# EAGLE schematic BMS Adapter Segment rev1 (EAGLE 8.1.0)
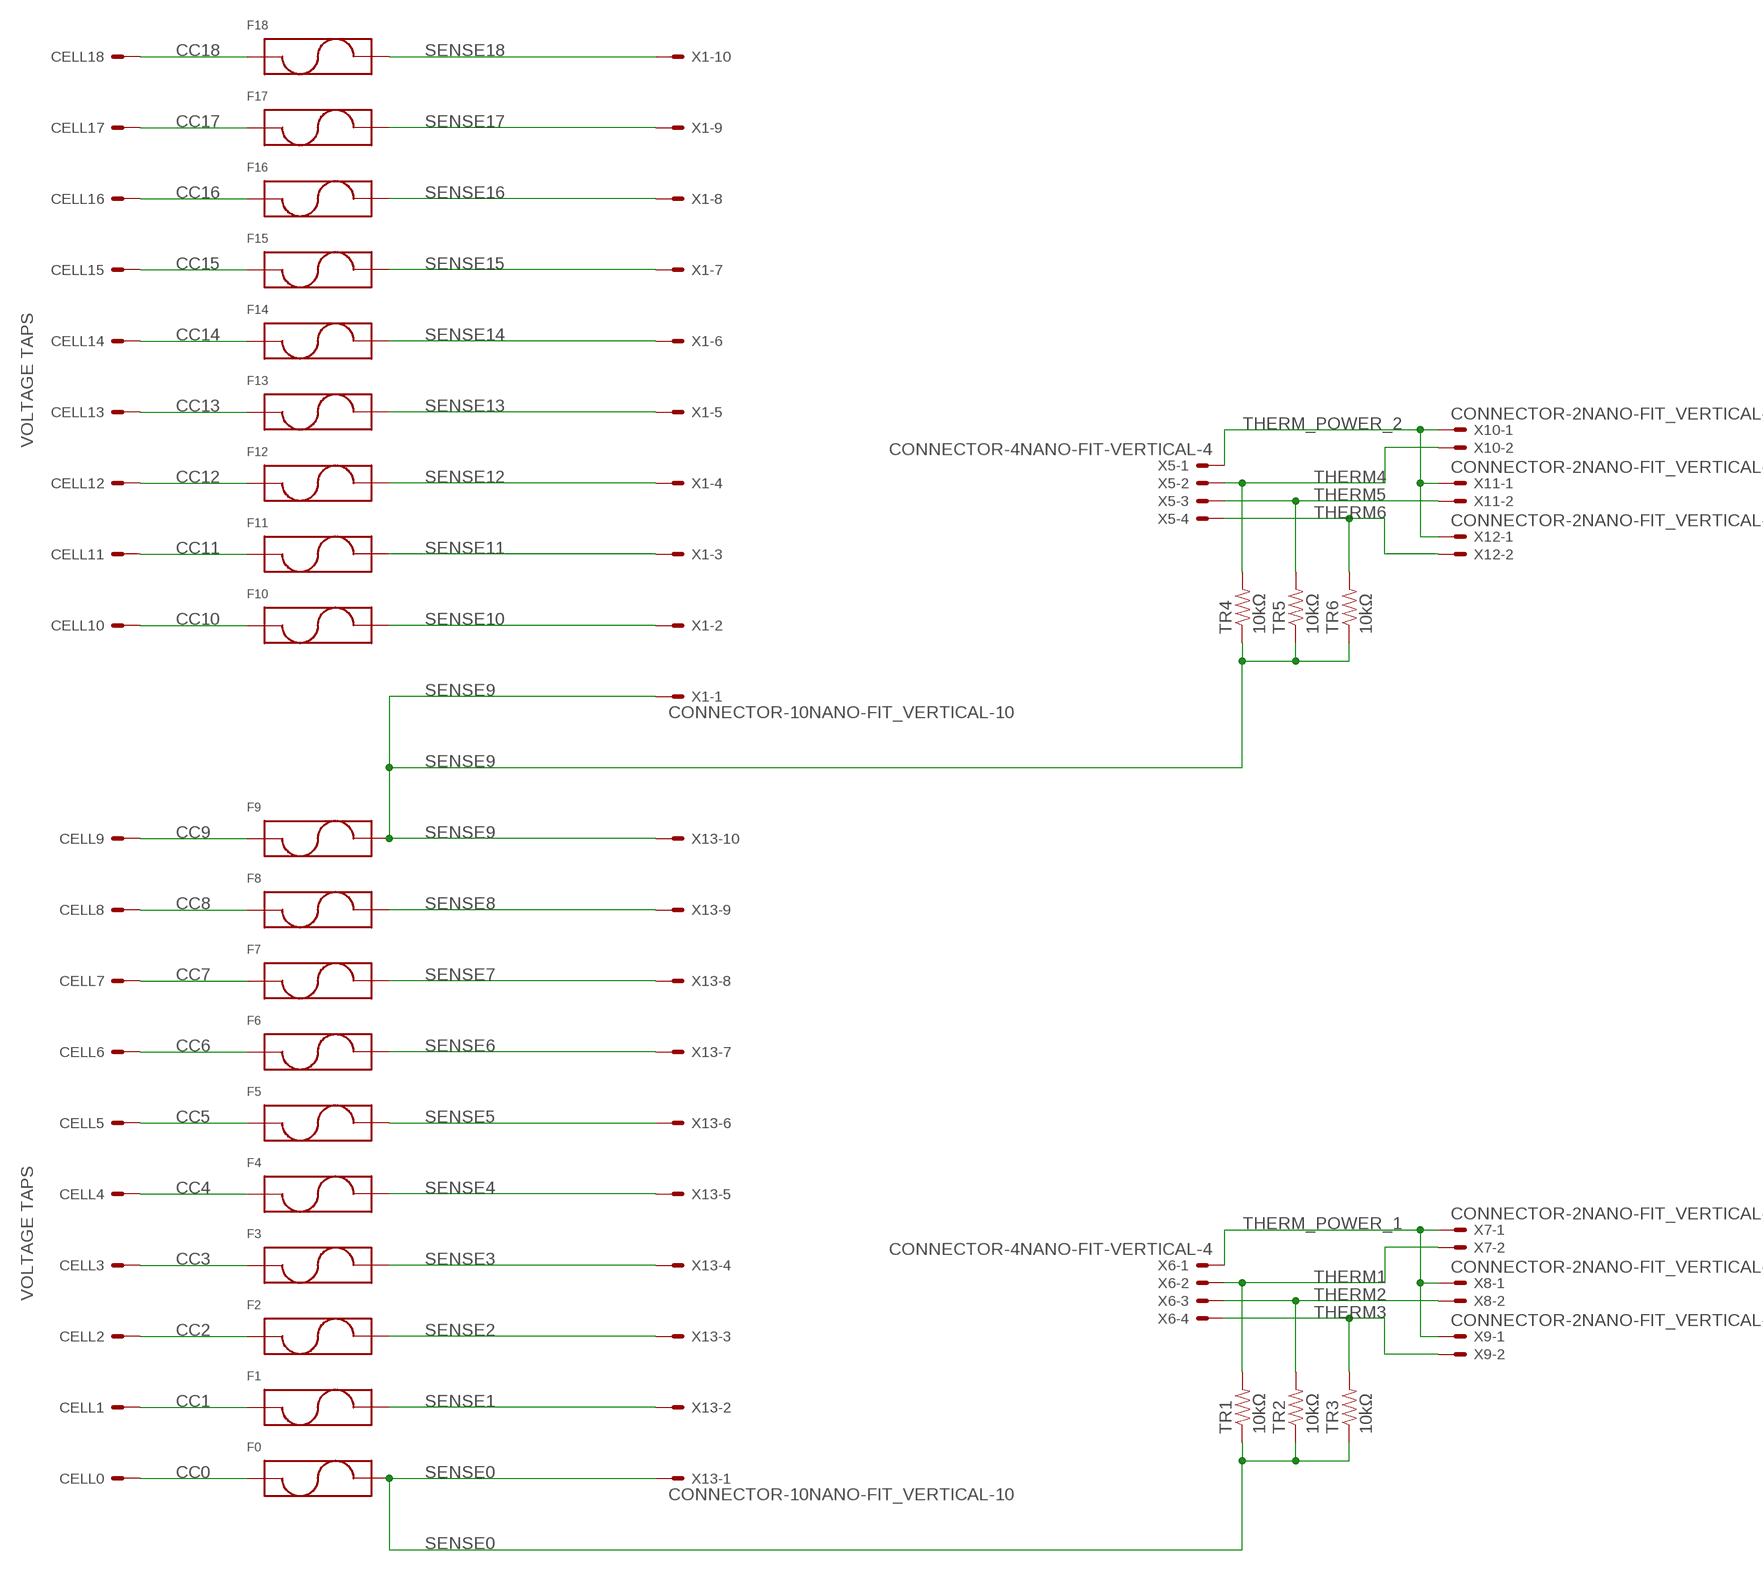
[diagram p0: schematic, sheet 1]

## Parts
CELL0  BATTERY_SPRING_KEYSTONE5222  [KEYSTONE5222]
CELL1  BATTERY_SPRING_KEYSTONE5222  [KEYSTONE5222]
CELL2  BATTERY_SPRING_KEYSTONE5222  [KEYSTONE5222]
CELL3  BATTERY_SPRING_KEYSTONE5222  [KEYSTONE5222]
CELL4  BATTERY_SPRING_KEYSTONE5222  [KEYSTONE5222]
CELL5  BATTERY_SPRING_KEYSTONE5222  [KEYSTONE5222]
CELL6  BATTERY_SPRING_KEYSTONE5222  [KEYSTONE5222]
CELL7  BATTERY_SPRING_KEYSTONE5222  [KEYSTONE5222]
CELL8  BATTERY_SPRING_KEYSTONE5222  [KEYSTONE5222]
CELL9  BATTERY_SPRING_KEYSTONE5222  [KEYSTONE5222]
CELL10  BATTERY_SPRING_KEYSTONE5222  [KEYSTONE5222]
CELL11  BATTERY_SPRING_KEYSTONE5222  [KEYSTONE5222]
CELL12  BATTERY_SPRING_KEYSTONE5222  [KEYSTONE5222]
CELL13  BATTERY_SPRING_KEYSTONE5222  [KEYSTONE5222]
CELL14  BATTERY_SPRING_KEYSTONE5222  [KEYSTONE5222]
CELL15  BATTERY_SPRING_KEYSTONE5222  [KEYSTONE5222]
CELL16  BATTERY_SPRING_KEYSTONE5222  [KEYSTONE5222]
CELL17  BATTERY_SPRING_KEYSTONE5222  [KEYSTONE5222]
CELL18  BATTERY_SPRING_KEYSTONE5222  [KEYSTONE5222]
F0  FUSE_OMF_250  [OMF_250]
F1  FUSE_OMF_250  [OMF_250]
F2  FUSE_OMF_250  [OMF_250]
F3  FUSE_OMF_250  [OMF_250]
F4  FUSE_OMF_250  [OMF_250]
F5  FUSE_OMF_250  [OMF_250]
F6  FUSE_OMF_250  [OMF_250]
F7  FUSE_OMF_250  [OMF_250]
F8  FUSE_OMF_250  [OMF_250]
F9  FUSE_OMF_250  [OMF_250]
F10  FUSE_OMF_250  [OMF_250]
F11  FUSE_OMF_250  [OMF_250]
F12  FUSE_OMF_250  [OMF_250]
F13  FUSE_OMF_250  [OMF_250]
F14  FUSE_OMF_250  [OMF_250]
F15  FUSE_OMF_250  [OMF_250]
F16  FUSE_OMF_250  [OMF_250]
F17  FUSE_OMF_250  [OMF_250]
F18  FUSE_OMF_250  [OMF_250]
TR1  10kΩ  RESISTOR0805-RES  [0805]
TR2  10kΩ  RESISTOR0805-RES  [0805]
TR3  10kΩ  RESISTOR0805-RES  [0805]
TR4  10kΩ  RESISTOR0805-RES  [0805]
TR5  10kΩ  RESISTOR0805-RES  [0805]
TR6  10kΩ  RESISTOR0805-RES  [0805]
X1  CONNECTOR-10NANO-FIT_VERTICAL-10  [NANO-FIT_VERTICAL-10]
X5  CONNECTOR-4NANO-FIT-VERTICAL-4  [NANO-FIT_VERTICAL-4]
X6  CONNECTOR-4NANO-FIT-VERTICAL-4  [NANO-FIT_VERTICAL-4]
X7  CONNECTOR-2NANO-FIT_VERTICAL-2  [NANO-FIT_VERTICAL-2]
X8  CONNECTOR-2NANO-FIT_VERTICAL-2  [NANO-FIT_VERTICAL-2]
X9  CONNECTOR-2NANO-FIT_VERTICAL-2  [NANO-FIT_VERTICAL-2]
X10  CONNECTOR-2NANO-FIT_VERTICAL-2  [NANO-FIT_VERTICAL-2]
X11  CONNECTOR-2NANO-FIT_VERTICAL-2  [NANO-FIT_VERTICAL-2]
X12  CONNECTOR-2NANO-FIT_VERTICAL-2  [NANO-FIT_VERTICAL-2]
X13  CONNECTOR-10NANO-FIT_VERTICAL-10  [NANO-FIT_VERTICAL-10]

## Nets
CC0: CELL0.P$1(S) F0.P$1(P1)
CC1: CELL1.P$1(S) F1.P$1(P1)
CC2: CELL2.P$1(S) F2.P$1(P1)
CC3: CELL3.P$1(S) F3.P$1(P1)
CC4: CELL4.P$1(S) F4.P$1(P1)
CC5: CELL5.P$1(S) F5.P$1(P1)
CC6: CELL6.P$1(S) F6.P$1(P1)
CC7: CELL7.P$1(S) F7.P$1(P1)
CC8: CELL8.P$1(S) F8.P$1(P1)
CC9: CELL9.P$1(S) F9.P$1(P1)
CC10: CELL10.P$1(S) F10.P$1(P1)
CC11: CELL11.P$1(S) F11.P$1(P1)
CC12: CELL12.P$1(S) F12.P$1(P1)
CC13: CELL13.P$1(S) F13.P$1(P1)
CC14: CELL14.P$1(S) F14.P$1(P1)
CC15: CELL15.P$1(S) F15.P$1(P1)
CC16: CELL16.P$1(S) F16.P$1(P1)
CC17: CELL17.P$1(S) F17.P$1(P1)
CC18: CELL18.P$1(S) F18.P$1(P1)
SENSE0: F0.P$2(P2) TR1.1 TR2.1 TR3.1 X13.P$1
SENSE1: F1.P$2(P2) X13.P$2
SENSE2: F2.P$2(P2) X13.P$3
SENSE3: F3.P$2(P2) X13.P$4
SENSE4: F4.P$2(P2) X13.P$5
SENSE5: F5.P$2(P2) X13.P$6
SENSE6: F6.P$2(P2) X13.P$7
SENSE7: F7.P$2(P2) X13.P$8
SENSE8: F8.P$2(P2) X13.P$9
SENSE9: F9.P$2(P2) TR4.1 TR5.1 TR6.1 X1.P$1 X13.P$10
SENSE10: F10.P$2(P2) X1.P$2
SENSE11: F11.P$2(P2) X1.P$3
SENSE12: F12.P$2(P2) X1.P$4
SENSE13: F13.P$2(P2) X1.P$5
SENSE14: F14.P$2(P2) X1.P$6
SENSE15: F15.P$2(P2) X1.P$7
SENSE16: F16.P$2(P2) X1.P$8
SENSE17: F17.P$2(P2) X1.P$9
SENSE18: F18.P$2(P2) X1.P$10
THERM1: TR1.2 X6.P$2 X7.P$2
THERM2: TR2.2 X6.P$3 X8.P$2
THERM3: TR3.2 X6.P$4 X9.P$2
THERM4: TR4.2 X5.P$2 X10.P$2
THERM5: TR5.2 X5.P$3 X11.P$2
THERM6: TR6.2 X5.P$4 X12.P$2
THERM_POWER_1: X6.P$1 X7.P$1 X8.P$1 X9.P$1
THERM_POWER_2: X5.P$1 X10.P$1 X11.P$1 X12.P$1

## Notes on the sheet
- VOLTAGE TAPS
- VOLTAGE TAPS

## Library data of the parts
CELL0 CELL1-CELL18 = HyTechDevices:BATTERY_SPRING
F0 F1-F18 = HyTechDevices:FUSE: Fuse/Fuseclips Keystone Electronics 3568 Fuse Mouser Part <http://www.mouser.com/ProductDetail/Keystone-Electronics/3568> Datasheet <http://www.mouser.com/ds/2/215/568-742601.pdf> Bussman/Eaton Midget Fuse Clip 1A3400 <http://www.mouser.com/ProductDetail/Bussmann-Eaton/BK-1A3400-09-R/?qs=sGAEpiMZZMuG%252bgnN5hGYGzzlAelq2OxnKqVSMVjq8I4%3d> Schurter 0751.0110 Brass Fuse Clip Datasheet <http://www.mouser.com/ds/2/358/typ_OG__Clip__5x20-2553.pdf>
TR1-TR6 = HyTechDevices:RESISTOR: Resistor Basic schematic elements and footprints for 0603, 1206, and PTH resistors.
X1 X13 = HyTechDevices:CONNECTOR-10: Mini-Fit Junior connector 10 pole Source: http://www.molex.com
X5 X6 = HyTechDevices:CONNECTOR-4: Mini-Fit Junior connector 4 pole Source: http://www.molex.com
X7-X12 = HyTechDevices:CONNECTOR-2: Mini-Fit Junior connector 2 pole Source: http://www.molex.com